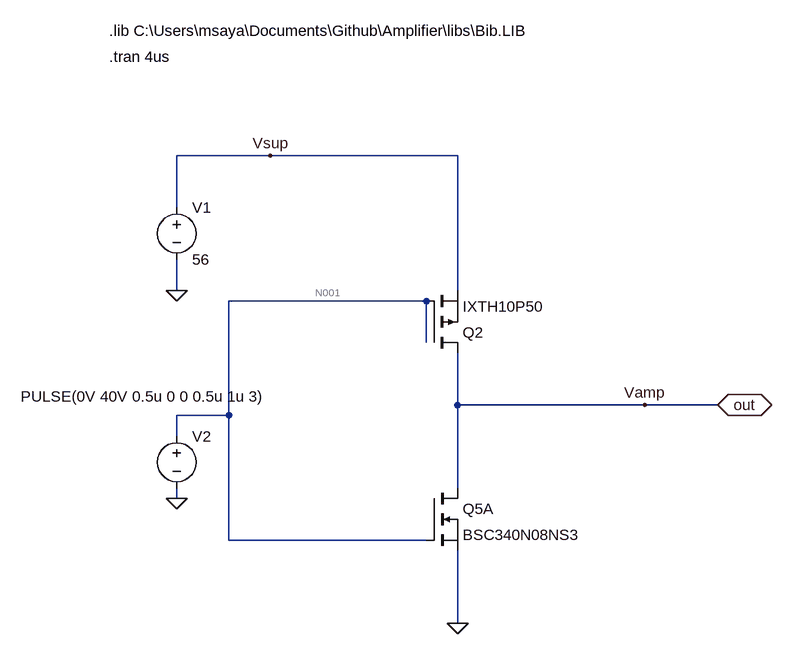
[diagram p0: schematic Switch.asc]
Switch.asc, the LTspice schematic file:
Version 4
SHEET 1 7116 2452
WIRE 704 -272 560 -272
WIRE 992 -272 704 -272
WIRE 560 -192 560 -272
WIRE 560 -64 560 -112
WIRE 992 -64 992 -272
WIRE 944 -48 640 -48
WIRE 944 16 944 -48
WIRE 992 112 992 32
WIRE 1280 112 992 112
WIRE 1392 112 1280 112
WIRE 640 128 640 -48
WIRE 640 128 560 128
WIRE 560 160 560 128
WIRE 992 240 992 112
WIRE 560 256 560 240
WIRE 640 320 640 128
WIRE 944 320 640 320
WIRE 992 448 992 336
FLAG 560 -64 0
FLAG 704 -272 Vsup
FLAG 560 256 0
FLAG 1392 112 out
IOPIN 1392 112 BiDir
FLAG 1280 112 Vamp
FLAG 992 448 0
SYMBOL voltage 560 -208 R0
WINDOW 123 0 0 Left 0
WINDOW 39 0 0 Left 0
SYMATTR InstName V1
SYMATTR Value 56
SYMBOL pmos 944 32 M180
SYMATTR InstName Q2
SYMATTR Value IXTH10P50
SYMBOL nmos 944 240 R0
SYMATTR InstName Q5A
SYMATTR Value BSC340N08NS3
SYMBOL voltage 560 144 R0
WINDOW 123 0 0 Left 0
WINDOW 39 0 0 Left 0
WINDOW 3 -240 -45 Left 2
SYMATTR Value PULSE(0V 40V 0.5u 0 0 0.5u 1u 3)
SYMATTR InstName V2
TEXT 456 -424 Left 2 !.tran 4us
TEXT 456 -464 Left 2 !.lib C:\\Users\\msaya\\Documents\\Github\\Amplifier\\libs\\Bib.LIB

The netlist it stands for:
* Switch.asc
V1 Vsup 0 56
M§Q2 Vamp N001 Vsup Vsup IXTH10P50
M§Q5A Vamp N001 0 0 BSC340N08NS3
V2 N001 0 PULSE(0V 40V 0.5u 0 0 0.5u 1u 3)
.model NMOS NMOS
.model PMOS PMOS
.lib standard.mos
.tran 4us
.lib C:\Users\msaya\Documents\Github\Amplifier\libs\Bib.LIB
.backanno
.end

* Results of the author's LTspice run, read from the files saved beside the schematic
* Operating Point, zero values left out:
*   V(vsup) = 56 V
*   V(vamp) = 56 V
*   Id(Q2) = -120 pA
*   Ib(Q2) = -7.105 µA
*   Is(Q2) = 121.5 pA
*   Id(Q5a) = 64.76 pA
*   Is(Q5a) = -64.76 pA
*   I(V1) = 7.629 µA
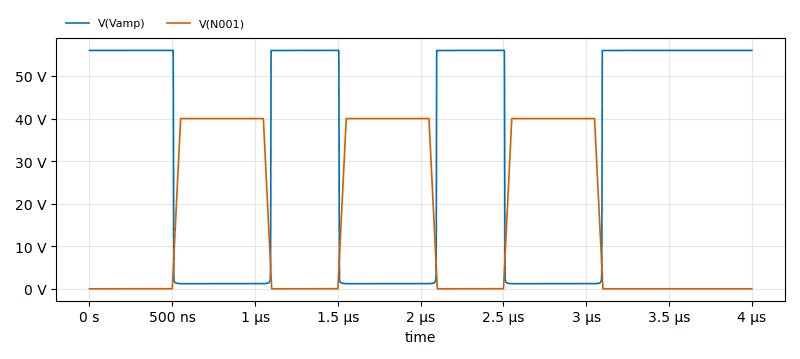
[diagram p1: Transient Analysis of Switch.asc, plotted from the saved traces]
* Transient Analysis, 1 run:
*   V(Vamp): min 1.2 V, max 56.02 V, average 31.87 V, rms 41.87 V, last 56 V
*   V(N001): min 0 V, max 40 V, average 16.5 V, rms 25.3 V, last 0 V